# Altium project Fri3D_2024_01.PrjPcb
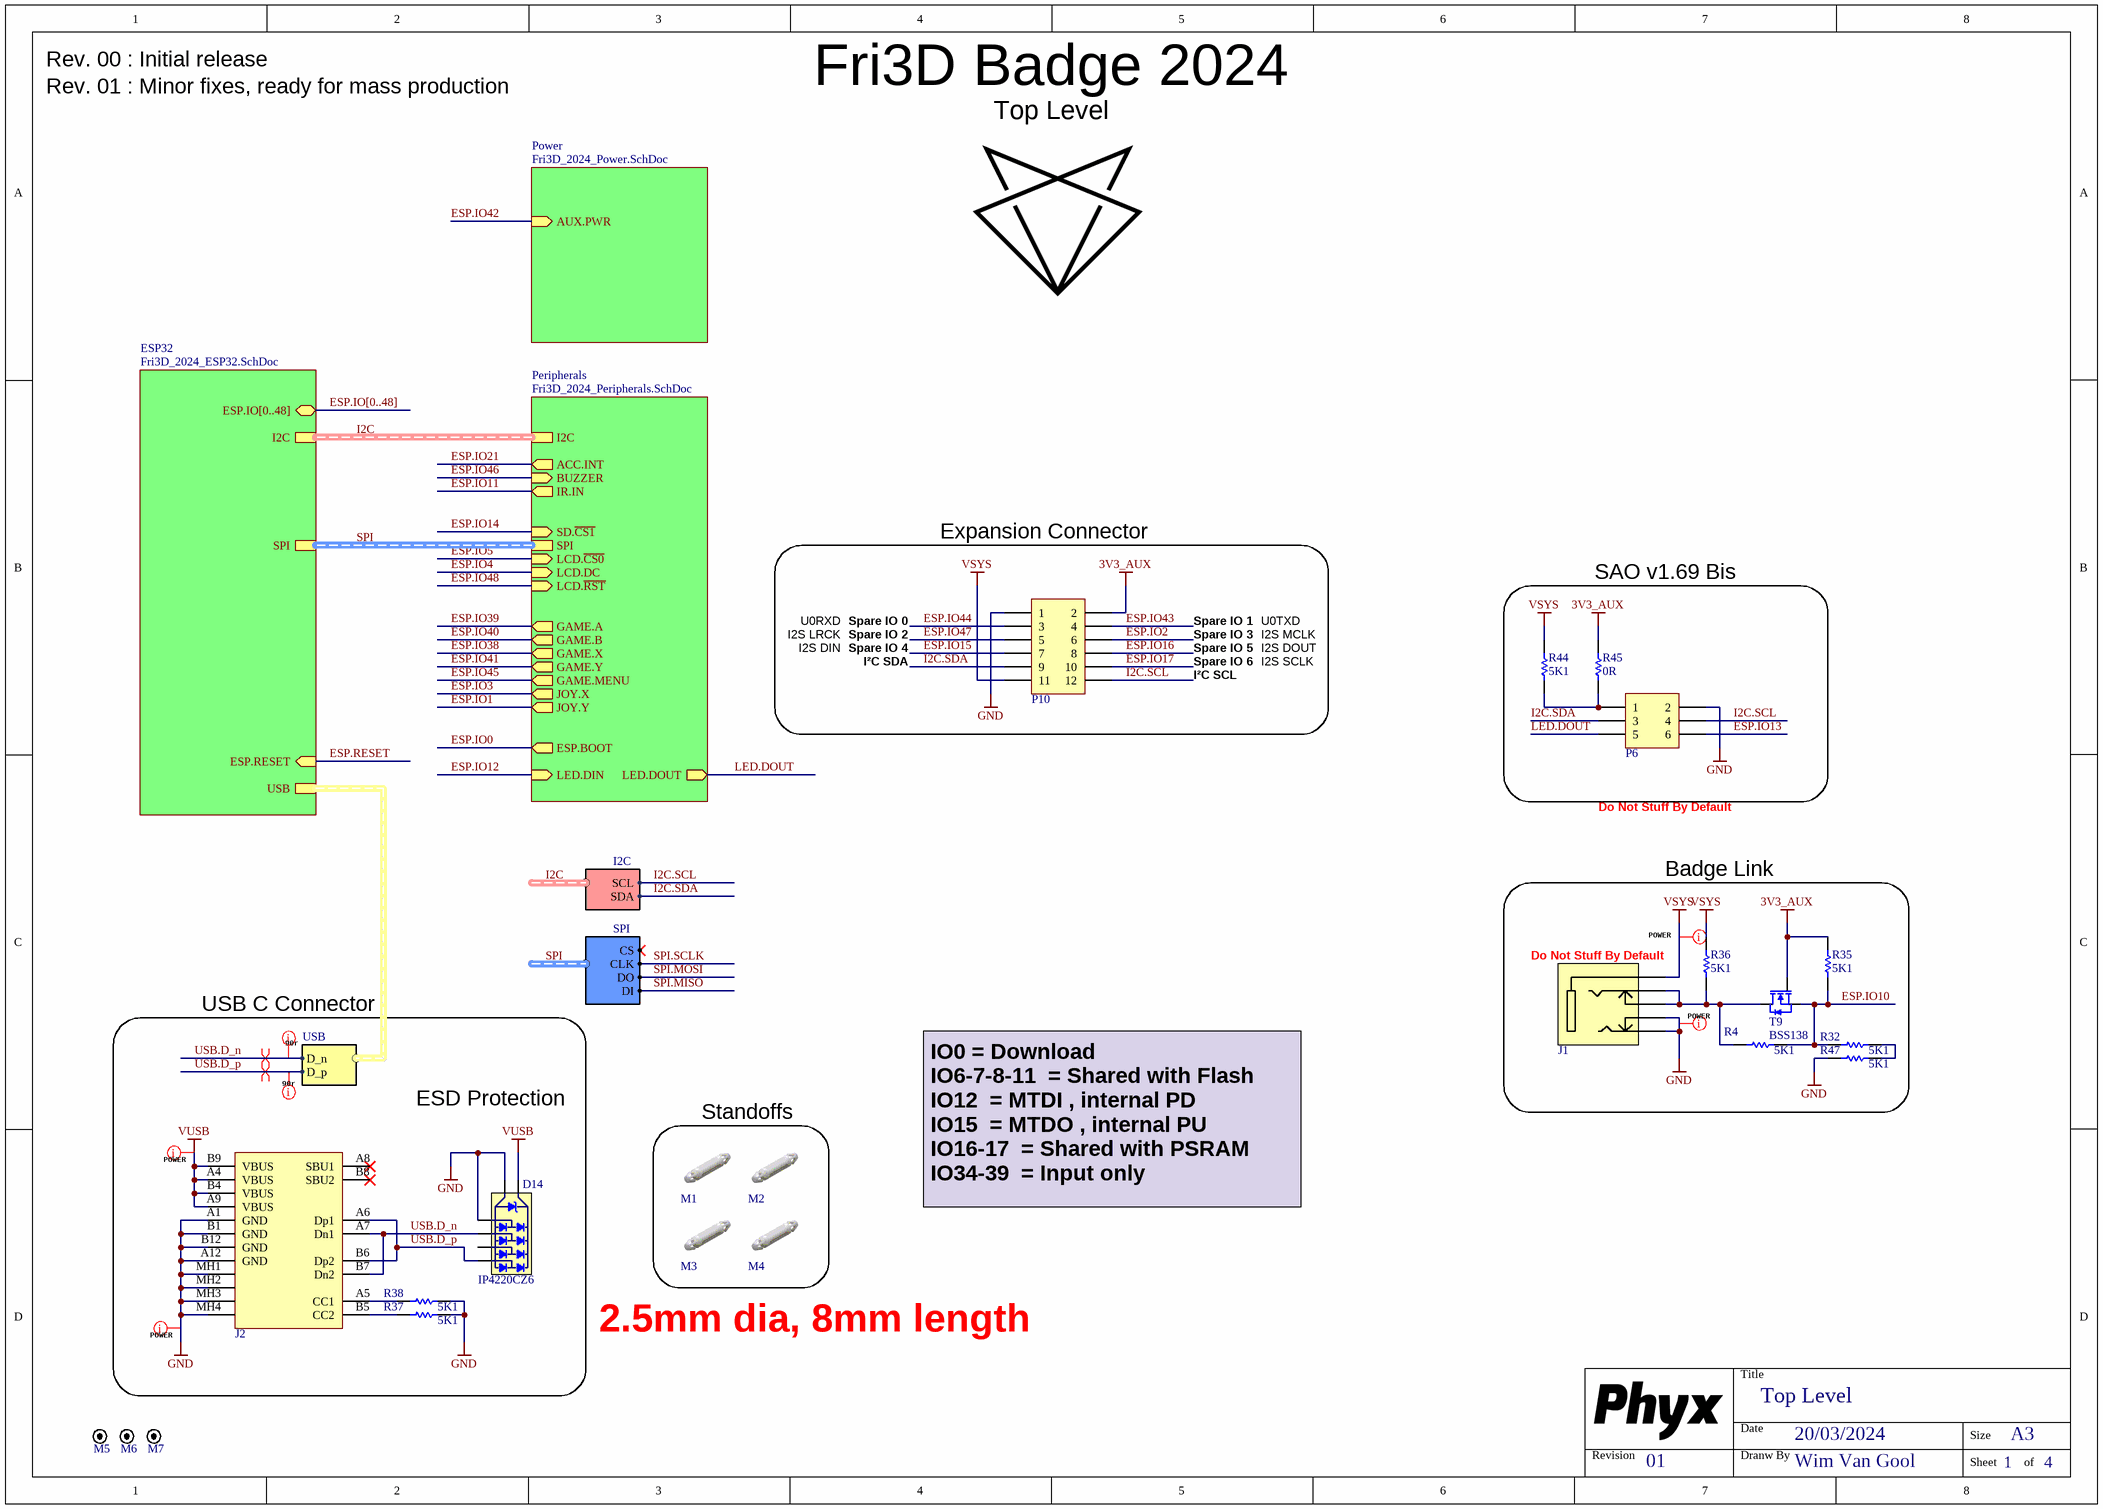
[diagram p0: Fri3D_2024_01.SchDoc]
PCB_TITLE: Fri3D Badge 2024; PCB_REV: 01; PCB_ENGINEER: WimVG
4 sheets, 104 parts. Net scope: hierarchical (ports join the sheet entries above them; power ports are global).
Board file: Fri3D_2024_01.PcbDoc
Sheets:
  Fri3D_2024_01.SchDoc
    Peripherals = Fri3D_2024_Peripherals.SchDoc
    Power = Fri3D_2024_Power.SchDoc
    ESP32 = Fri3D_2024_ESP32.SchDoc

## Sheet Fri3D_2024_01.SchDoc: Top Level
size A3; Date: 20/03/2024; DrawnBy: Wim Van Gool; DocumentNumber: 1; Revision: 01; SheetNumber: 1; SheetTotal: 4

### Parts
D14  value IP4220CZ6  [NXP_SOT457]  (hidden comment: TVS Diode Dual USB)
J1  3.5mm jack, dual switch, black, 3 contacts  [CUI_SJ1-3525NG]  (value not drawn)
J2  USB 2.0 C Reversible Receptacle Horizontal full SMD  [XUNPU-TYPEC-304S-ACP16]  (value not drawn)
M1  HIWA LCC-12 Snap-in - Snap-in 12.7mm  [WE_709622400]  (value not drawn)
M2  HIWA LCC-12 Snap-in - Snap-in 12.7mm  [WE_709622400]  (value not drawn)
M3  HIWA LCC-12 Snap-in - Snap-in 12.7mm  [WE_709622400]  (value not drawn)
M4  HIWA LCC-12 Snap-in - Snap-in 12.7mm  [WE_709622400]  (value not drawn)
M5  Fiducial 0.5mm  [FID_0.5mm]  (value not drawn)
M6  Fiducial 0.5mm  [FID_0.5mm]  (value not drawn)
M7  Fiducial 0.5mm  [FID_0.5mm]  (value not drawn)
P6  Receptacle 3x2  [RCPT2X3]  (value not drawn)
P10  Receptacle 6x2 SMD low profile  [WE_610312243021_POST]  (value not drawn)
R4  value 5K1  [R0603_N]  (hidden comment: RESISTOR)
R32  value 5K1  [R0603_N]  (hidden comment: RESISTOR)
R35  value 5K1  [R0603_N]  (hidden comment: RESISTOR)
R36  value 5K1  [R0603_N]  (hidden comment: RESISTOR)
R37  value 5K1  [R0603_N]  (hidden comment: RESISTOR)
R38  value 5K1  [R0603_N]  (hidden comment: RESISTOR)
R44  value 5K1  [R0603_N]  (hidden comment: RESISTOR)
R45  value 0R  [R0603_N]  (hidden comment: RESISTOR)
R47  value 5K1  [R0603_N]  (hidden comment: RESISTOR)
T9  value BSS138  [SOT23-3]  (hidden comment: 0.2A N-Ch MOSFET Vgs 3.2)

### Blocks framed on the sheet
Expansion Connector: P10
SAO v1.69 Bis: P6 R44 R45
Badge Link: J1 R4 R32 R35 R36 R47 T9
Standoffs: M1-M4

### Sub-sheets
ESP32 = Fri3D_2024_ESP32.SchDoc: I2C (harness I2C), USB (harness USB), SPI (harness SPI), ESP.RESET (in), ESP.IO[0..48] (bidir)
Peripherals = Fri3D_2024_Peripherals.SchDoc: I2C (harness I2C), ACC.INT (out), BUZZER (in), LED.DIN (in), LED.DOUT (out), SPI (harness SPI), IR.IN (out), LCD.DC (in), LCD.~{RST} (in), LCD.~{CS0} (in), ESP.BOOT (out), GAME.A (out), GAME.B (out), GAME.Y (out), GAME.X (out), GAME.MENU (out), SD.~{CS1} (in), JOY.X (out), JOY.Y (out)
Power = Fri3D_2024_Power.SchDoc: AUX.PWR (in)

### Harnesses
USB: D_p, D_n
I2C: SDA, SCL
SPI: CS, CLK, DO, DI

### Nets
3V3_AUX: P10.2 R35.1 R45.1 T9.1(G)
GND: D14.2(GND) D14.3 J1.2(Tip) J1.4 J2.A1(GND) J2.A12(GND) J2.B1(GND) J2.B12(GND) J2.MH1(Tab) J2.MH2(Tab) J2.MH3(Tab) J2.MH4(Tab) P6.2 P10.1 R37.2 R38.2 R47.2
VSYS: J1.1(Sleeve) P10.11 R36.1 R44.2
VUSB: D14.5(VBus) J2.A4(VBUS) J2.A9(VBUS) J2.B4(VBUS) J2.B9(VBUS)
ESP.IO2: P10.6
ESP.IO10: R4.1 R32.2 R35.2 T9.2(S)
ESP.IO13: P6.6  [project net BAT.MON]
ESP.IO15: P10.7
ESP.IO16: P10.8
ESP.IO17: P10.10
ESP.IO43: P10.4
ESP.IO44: P10.3
ESP.IO47: P10.5
I2C.SCL: P6.4 P10.12 ; sheet Peripherals/I2C.SCL
I2C.SDA: P6.3 P10.9 ; sheet Peripherals/I2C.SDA  [project net ESP.IO9]
LED.DOUT: P6.5 ; sheet Peripherals/LED.DOUT
USB.D_n: D14.1 J2.A7(Dn1) J2.B7(Dn2) ; sheet ESP32/USB.D_n
USB.D_p: D14.6 J2.A6(Dp1) J2.B6(Dp2) ; sheet ESP32/USB.D_p
NetJ1_3: J1.3(Ring) J1.5 R4.2 R36.2 T9.3(D)
NetJ2_A5: J2.A5(CC1) R38.1
NetJ2_B5: J2.B5(CC2) R37.1
NetP6_1: P6.1 R44.1 R45.2
NetR32_1: R32.1 R47.1

Not connected (* = marked no-connect by the designer): D14 4; J2 A8(SBU1)* B8(SBU2)*

### Buses and harness runs
bus ESP.IO[0..48] = sheet ESP32/ESP.IO[0..48]
harness I2C = sheet ESP32/I2C = sheet Peripherals/I2C
harness SPI = sheet ESP32/SPI = sheet Peripherals/SPI

### Layout directives
net class 90r: USB.D_n, USB.D_p
differential pair: USB.D_n, USB.D_p
net class POWER: GND, VSYS, VUSB

### Notes on the sheet
- Rev. 00 : Initial release
- Rev. 01 : Minor fixes, ready for mass production
- I2S LRCK
- I2S DIN
- U0RXD
- Spare IO 0
- I²C SDA
- Spare IO 2
- Spare IO 4
- Spare IO 1
- Spare IO 3
- Spare IO 5
- Spare IO 6
- I2S MCLK
- I2S SCLK
- I2S DOUT
- U0TXD
- I²C SCL
- Do Not Stuff By Default
- (near J1) Do Not Stuff By Default
- USB C Connector
- ESD Protection
- IO0	= Download
  IO6-7-8-11 	= Shared with Flash
  IO12 	= MTDI , internal PD
  IO15 	= MTDO , internal PU
  IO16-17 	= Shared with PSRAM
  IO34-39 	= Input only
- 2.5mm dia, 8mm length
- Title
- Revision
- Date
- Dranw By
- Size
- A3
- Sheet
- of

### Library data of the parts
D14 = TVS # IP4220CZ6 Dual USB: =Description; Supplier 1: Farnell; Supplier Part Number 1: 2143248
J1 = AUDIO JACK 3.5 3c SJ1-3525NG: =Description; Value: SJ1-3525NG; Supplier 1: Digi-key; Supplier Part Number 1: CP1-3525NG-ND
J2 = USB # C 2.0 RCPT TYPEC-304S-ACP16: Value: TYPEC-304S-ACP16; Supplier 1: LCSC; Supplier Part Number 1: C720630
M1-M4 = SPACER SNAP-SNAP LCC-12 -12.7mm: Value: LCC-12; Supplier 1: LCSC; Supplier Part Number 1: C155856
M5-M7 = Fiducial 0.5mm: FIDUCIAL; Value: NO BOM; Supplier 1: XXX; Supplier Part Number 1: FOOTPRINT ONLY
P6 = Receptacle 2.54mm dual row 6way
P10 = Receptacle # 2.54mm dual row 12way 610312243021: Value: 610312243021; Supplier 1: Wurth; Supplier Part Number 1: 610312243021; Supplier 2: Mouser; Supplier Part Number 2: 710-610312243021
R4 R32 R35-R38 R44 R47 = RES # 5K1 0603: Supplier 1: Farnell; Supplier Part Number 1: 2845922
  R4 R36: Supplier 2: LCSC; Supplier Part Number 2: C112314; Supplier 3: Generic; Supplier Part Number 3: 5K1 1% 0603
R45 = RES # 0R 0603: Supplier 1: Farnell; Supplier Part Number 1: 2447743; Supplier 3: Generic; Supplier Part Number 3: 0R 1% 0603
T9 = BSS138 N-Ch MOSFET 0.2A 3.2Vgs 60Vds: Supplier 1: Farnell; Supplier Part Number 1: 2432717

## Sheet Fri3D_2024_Peripherals.SchDoc: Peripherals
size A3; Date: 20/03/2024; DrawnBy: Wim Van Gool; DocumentNumber: 3; Revision: 01; SheetNumber: 3; SheetTotal: 4
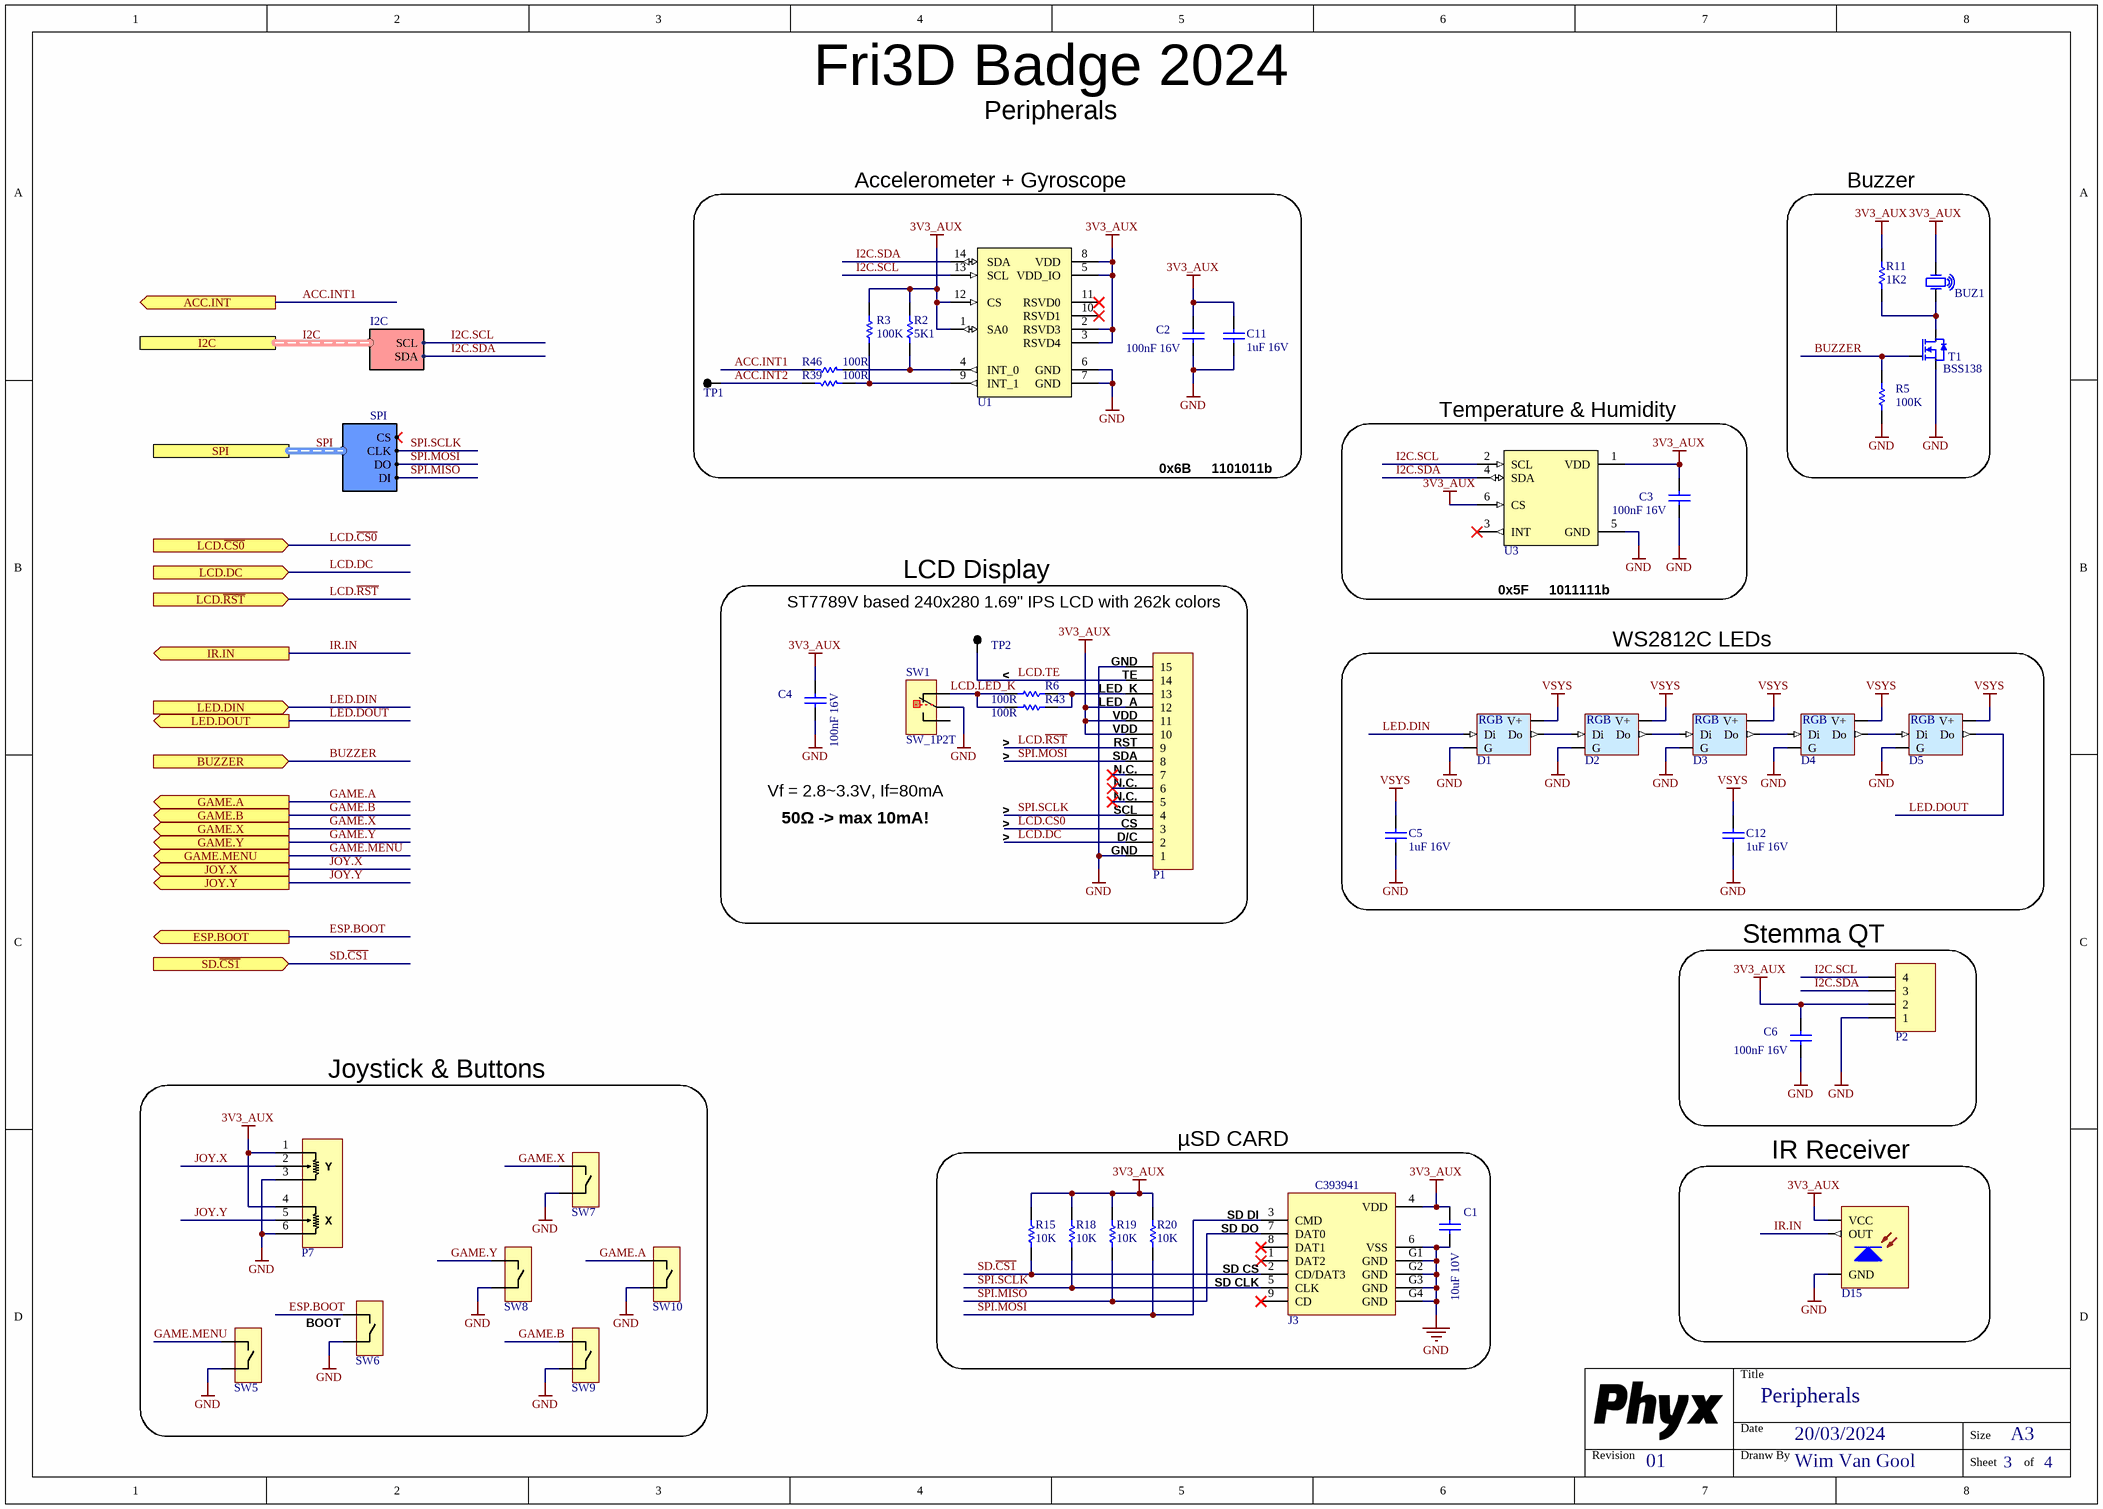
[diagram p1: Fri3D_2024_Peripherals.SchDoc]

### Parts
BUZ1  12x12x3mm Piezo Buzzer Transducer 81dB  [CUI_CMT-1203-SMT]  (value not drawn)
C1  value 10uF 10V  [C0805_N]  (hidden comment: CAP_CERAMIC)
C2  value 100nF 16V  [C0603_N]
C3  value 100nF 16V  [C0603_N]
C4  value 100nF 16V  [C0603_N]
C5  value 1uF 16V  [C0603_N]  (hidden comment: CAP_CERAMIC)
C6  value 100nF 16V  [C0603_N]
C11  value 1uF 16V  [C0603_N]  (hidden comment: CAP_CERAMIC)
C12  value 1uF 16V  [C0603_N]  (hidden comment: CAP_CERAMIC)
D1  WS2812 based digital RGB LED 5050 White package reduced current  [LED_5050_WS2812B_WHITE]  (value not drawn)
D2  WS2812 based digital RGB LED 5050 White package reduced current  [LED_5050_WS2812B_WHITE]  (value not drawn)
D3  WS2812 based digital RGB LED 5050 White package reduced current  [LED_5050_WS2812B_WHITE]  (value not drawn)
D4  WS2812 based digital RGB LED 5050 White package reduced current  [LED_5050_WS2812B_WHITE]  (value not drawn)
D5  WS2812 based digital RGB LED 5050 White package reduced current  [LED_5050_WS2812B_WHITE]  (value not drawn)
D15  ZIRM-5042B-42-Z2 Infrared Receiver 38 kHz 45° 2.7-5.5V 940nm  [CHAU_ZIRM-5042B-42-Z2]  (value not drawn)
J3  Supplier Part Number 1: C393941  [TFP09-2-12B]  (hidden comment: Micro SD PiPo Push-Push)
P1  Top contact FPC 0.3mm pitch 15 contacts  [FPC_0.3K-HX-15PWB]  (value not drawn)
P2  Header 1.0mm RA Shrouded 4  [WE_665104131822]  (value not drawn)
P7  PSP Mini Joystick  [PSP_Mini_Joystick]  (value not drawn)
R2  value 5K1  [R0603_N]  (hidden comment: RESISTOR)
R3  value 100K  [R0603_N]  (hidden comment: RESISTOR)
R5  value 100K  [R0603_N]  (hidden comment: RESISTOR)
R6  value 100R  [R0603_N]  (hidden comment: RESISTOR)
R11  value 1K2  [R0603_N]  (hidden comment: RESISTOR)
R15  value 10K  [R0603_N]  (hidden comment: RESISTOR)
R18  value 10K  [R0603_N]  (hidden comment: RESISTOR)
R19  value 10K  [R0603_N]  (hidden comment: RESISTOR)
R20  value 10K  [R0603_N]  (hidden comment: RESISTOR)
R39  value 100R  [R0603_N]  (hidden comment: RESISTOR)
R43  value 100R  [R0603_N]  (hidden comment: RESISTOR)
R46  value 100R  [R0603_N]  (hidden comment: RESISTOR)
SW1  SW_1P2T  [WE_450404015514]
SW5  SKPMAME010 6x6 TACTG Switch  [ALPS_SKPMAME010]  (value not drawn)
SW6  SKPMAME010 6x6 TACTG Switch  [ALPS_SKPMAME010]  (value not drawn)
SW7  SKPMAME010 6x6 TACTG Switch  [ALPS_SKPMAME010]  (value not drawn)
SW8  SKPMAME010 6x6 TACTG Switch  [ALPS_SKPMAME010]  (value not drawn)
SW9  SKPMAME010 6x6 TACTG Switch  [ALPS_SKPMAME010]  (value not drawn)
SW10  SKPMAME010 6x6 TACTG Switch  [ALPS_SKPMAME010]  (value not drawn)
T1  value BSS138  [SOT23-3]  (hidden comment: 0.2A N-Ch MOSFET Vgs 3.2)
TP1  TEST_PAD  [TP_1.2mm]  (value not drawn)
TP2  TEST_PAD  [TP_1.2mm]  (value not drawn)
U1  Acceleration ±2, ±4, ±8, ±16g Gyro ±125, ±250, ±500, ±1000, ±2000dps  [WE_2536030320001]  (value not drawn)
U3  WSEN-HIDS 2525020210001 temperature and humidity sensor Digital I2C  [WE_2525020210001]  (value not drawn)

### Blocks framed on the sheet
Accelerometer + Gyroscope: C2 C11 R2 R3 R39 R46 TP1 U1
Buzzer: BUZ1 R5 R11 T1
Temperature & Humidity: C3 U3
LCD Display: C4 P1 R6 R43 SW1 TP2
WS2812C LEDs: C5 C12 D1-D5
Stemma QT: C6 P2
Joystick & Buttons: P7 SW5-SW10
µSD CARD: C1 J3 R15 R18-R20
IR Receiver: D15

### Ports
ACC.INT (out), BUZZER (in), ESP.BOOT (out), GAME.A (out), GAME.B (out), GAME.MENU (out), GAME.X (out), GAME.Y (out), I2C (harness I2C), IR.IN (out), JOY.X (out), JOY.Y (out), LCD.DC (in), LCD.~{CS0} (in), LCD.~{RST} (in), LED.DIN (in), LED.DOUT (out), SD.~{CS1} (in), SPI (harness SPI)

### Harnesses
I2C: SDA, SCL
SPI: CS, CLK, DO, DI

### Nets
3V3_AUX: BUZ1.2(OSC2) C1.1 C2.1 C3.1 C4.1 C6.1 C11.1 D15.3(VCC) J3.4(VDD) P1.10 P1.11 P1.12 P2.2 P7.1 P7.4 R2.1 R3.1 R11.2 R15.1 R18.1 R19.1 R20.1 U1.1(SA0) U1.2(RSVD3) U1.3(RSVD4) U1.5(VDD_IO) U1.8(VDD) U1.12(CS) U3.1(VDD) U3.6(CS)
GND: C1.2 C2.2 C3.2 C4.2 C5.2 C6.2 C11.2 C12.2 D1.3(G) D2.3(G) D3.3(G) D4.3(G) D5.3(G) D15.2(GND) J3.6(VSS) J3.G1(GND) J3.G2(GND) J3.G3(GND) J3.G4(GND) P1.1 P1.15 P2.1 P7.3 P7.6 R5.2 SW1.2 SW5.2 SW6.2 SW7.2 SW8.2 SW9.2 SW10.2 T1.2(S) U1.6(GND) U1.7(GND) U3.5(GND)
VSYS: C5.1 C12.1 D1.1(V+) D2.1(V+) D3.1(V+) D4.1(V+) D5.1(V+)
ACC.INT1: R46.2 ; port ACC.INT
ACC.INT2: R39.2 TP1.1
BUZZER: R5.1 T1.1(G) ; port BUZZER
ESP.BOOT: SW6.1 ; port ESP.BOOT
GAME.A: SW10.1 ; port GAME.A  [project net ESP.IO39]
GAME.B: SW9.1 ; port GAME.B  [project net ESP.IO40]
GAME.MENU: SW5.1 ; port GAME.MENU  [project net ESP.IO45]
GAME.X: SW7.1 ; port GAME.X  [project net ESP.IO38]
GAME.Y: SW8.1 ; port GAME.Y  [project net ESP.IO41]
I2C.SCL: P2.4 U1.13(SCL) U3.2(SCL) ; port I2C.SCL
I2C.SDA: P2.3 U1.14(SDA) U3.4(SDA) ; port I2C.SDA  [project net ESP.IO9]
IR.IN: D15.1(OUT) ; port IR.IN  [project net ESP.IO11]
JOY.X: P7.2 ; port JOY.X  [project net ESP.IO3]
JOY.Y: P7.5 ; port JOY.Y  [project net ESP.IO1]
LCD.~{CS0}: P1.3 ; port LCD.~{CS0}  [project net ESP.IO5]
LCD.DC: P1.2 ; port LCD.DC  [project net ESP.IO4]
LCD.LED_K: R6.2 R43.2 SW1.1
LCD.~{RST}: P1.9 ; port LCD.~{RST}  [project net ESP.IO48]
LCD.TE: P1.14 TP2.1
LED.DIN: D1.4(Di) ; port LED.DIN  [project net ESP.IO12]
LED.DOUT: D5.2(Do) ; port LED.DOUT
SD.~{CS1}: J3.2(CD/DAT3) R15.2 ; port SD.~{CS1}  [project net ESP.IO14]
SPI.MISO: J3.7(DAT0) R19.2 ; port SPI.DI  [project net ESP.IO8]
SPI.MOSI: J3.3(CMD) P1.8 R20.2 ; port SPI.DO  [project net ESP.IO6]
SPI.SCLK: J3.5(CLK) P1.4 R18.2 ; port SPI.CLK  [project net ESP.IO7]
NetBUZ1_1: BUZ1.1(OSC1) R11.1 T1.3(D)
NetD1_2: D1.2(Do) D2.4(Di)
NetD2_2: D2.2(Do) D3.4(Di)
NetD3_2: D3.2(Do) D4.4(Di)
NetD4_2: D4.2(Do) D5.4(Di)
NetP1_13: P1.13 R6.1 R43.1
NetR2_2: R2.2 R46.1 U1.4(INT_0)
NetR3_2: R3.2 R39.1 U1.9(INT_1)

Not connected (* = marked no-connect by the designer): J3 1(DAT2)* 8(DAT1)* 9(CD)*; P1 5* 6* 7*; SW1 3; U1 10(RSVD1)* 11(RSVD0)*; U3 3(INT)*

### Buses and harness runs
harness I2C = port I2C
harness SPI = port SPI

### Notes on the sheet
- 0x6B
- 1101011b
- (near TP2) ST7789V based 240x280 1.69" IPS LCD with 262k colors
- (near P1) GND
- (near U3) 0x5F
- (near U3) 1011111b
- (near R6) <
- (near P1) VDD
- (near P1) LED_A
- (near P1) LED_K
- (near P1) TE
- >
- (near P1) N.C.
- (near P1) SDA
- (near P1) RST
- Vf = 2.8~3.3V, If=80mA
- 50Ω -> max 10mA!
- (near P1) D/C
- (near P1) CS
- (near P1) SCL
- (near J3) SD DI
- (near J3) SD DO
- (near J3) SD CS
- (near SW6) BOOT
- (near J3) SD CLK
- Title
- Revision
- Date
- Dranw By
- Size
- A3
- Sheet
- of
- (in symbol JOY # PSP Mini Joystick) Y; X
- (in symbol LED # RGB WS2812C-5050 WH) RGB

### Library data of the parts
BUZ1 = BUZ # CUI CMT-1203-SMT: Crystal Oscillator; Value: CMT-1203-SMT; Supplier 1: Digikey; Supplier Part Number 1: 102-2197-1-ND; Supplier 2: Aliexpress; Supplier Part Number 2: KLJ-1230
C1 = CAP # 10uF 10V 0805: Capacitor Ceramic; Supplier 1: Farnell; Supplier Part Number 1: 2320859
C2-C4 C6 = CAP # 100nF 16V 0603: Capacitor Ceramic
C5 C11 C12 = CAP # 1uF 16V 0603: Capacitor Ceramic; Supplier 1: Farnell; Supplier Part Number 1: 2320814
D1-D5 = LED # RGB WS2812C-5050 WH: =Description; Value: WS218C 5050 WH; Supplier 1: Aliexpress; Supplier Part Number 1: WS2812C Black 5050; Supplier 2: LCSC; Supplier Part Number 2: C114587
D15 = PHO # IR Rx 940nm ZIRM-5042B-42-Z2: =Description; Value: ZIRM-5042B-42-Z2; Supplier 1: LCSC; Supplier Part Number 1: C575386
J3 = MicroSD TFP09-2-12B Push-Push: =Description; Value: TFP09-2-12B; Supplier 1: LCSC
P1 = FPC # 15 Top 0.3mm 0.3K-HX-15PWB: Value: 0.3K-HX-15PWB; Supplier 1: LCSC; Supplier Part Number 1: C2919525
P2 = HDR # RA SHR 1.0mm 4way - 665104131822: Value: 665104131822; Supplier 1: Wurth; Supplier Part Number 1: 665104131822; Supplier 2: Mouser; Supplier Part Number 2: 710-665104131822
P7 = JOY # PSP Mini Joystick: Value: PSP Mini Joystick; Supplier 1: AliExpress; Supplier Part Number 1: 32958017132
R2 = RES # 5K1 0603: Supplier 3: Generic; Supplier Part Number 3: 5K1 1% 0603; Supplier 1: Farnell; Supplier Part Number 1: 2845922; Supplier 2: LCSC; Supplier Part Number 2: C112314
R3 R5 = RES # 100K 0603: Supplier 3: Generic; Supplier Part Number 3: 100K 1% 0603
R6 R39 R43 R46 = RES # 100R 0603
R11 = RES # 1K2 0603
R15 R18-R20 = RES # 10K 0603: Supplier 1: Farnell; Supplier Part Number 1: 2502397
SW1 = SW # 1P2T WS-SLSU mini slide 6,7 x 2,7 mm
SW5-SW10 = SW # TACT ALPS SKPMAME010: Value: SKPMAME010; Supplier 1: LCSC; Supplier Part Number 1: C115348; Supplier 2: Farnell; Supplier Part Number 2: 2056804; Supplier 3: Mouser; Supplier Part Number 3: 688-SKPMAM
T1 = BSS138 N-Ch MOSFET 0.2A 3.2Vgs 60Vds: Supplier 1: Farnell; Supplier Part Number 1: 2432717
TP1 TP2 = TP # 1.2mm: Value: NO BOM
U1 = ACCELERO GYRO # WSEN-ISDS: =Description; Value: 2536030320001; Supplier 1: Würth; Supplier Part Number 1: 2536030320001
U3 = TMP HUM # WSEN-HIDS: =Description; Value: 2525020210001; Supplier 1: Digi-key; Supplier Part Number 1: 1917-2525020210001CT-ND; Supplier 2: Farnell; Supplier Part Number 2: 3759082; Supplier 3: Mouser; Supplier Part Number 3: 710-2525020210001

## Sheet Fri3D_2024_Power.SchDoc: Power
size A3; Date: 20/03/2024; DrawnBy: Wim Van Gool; DocumentNumber: 4; Revision: 01; SheetNumber: 4; SheetTotal: 4
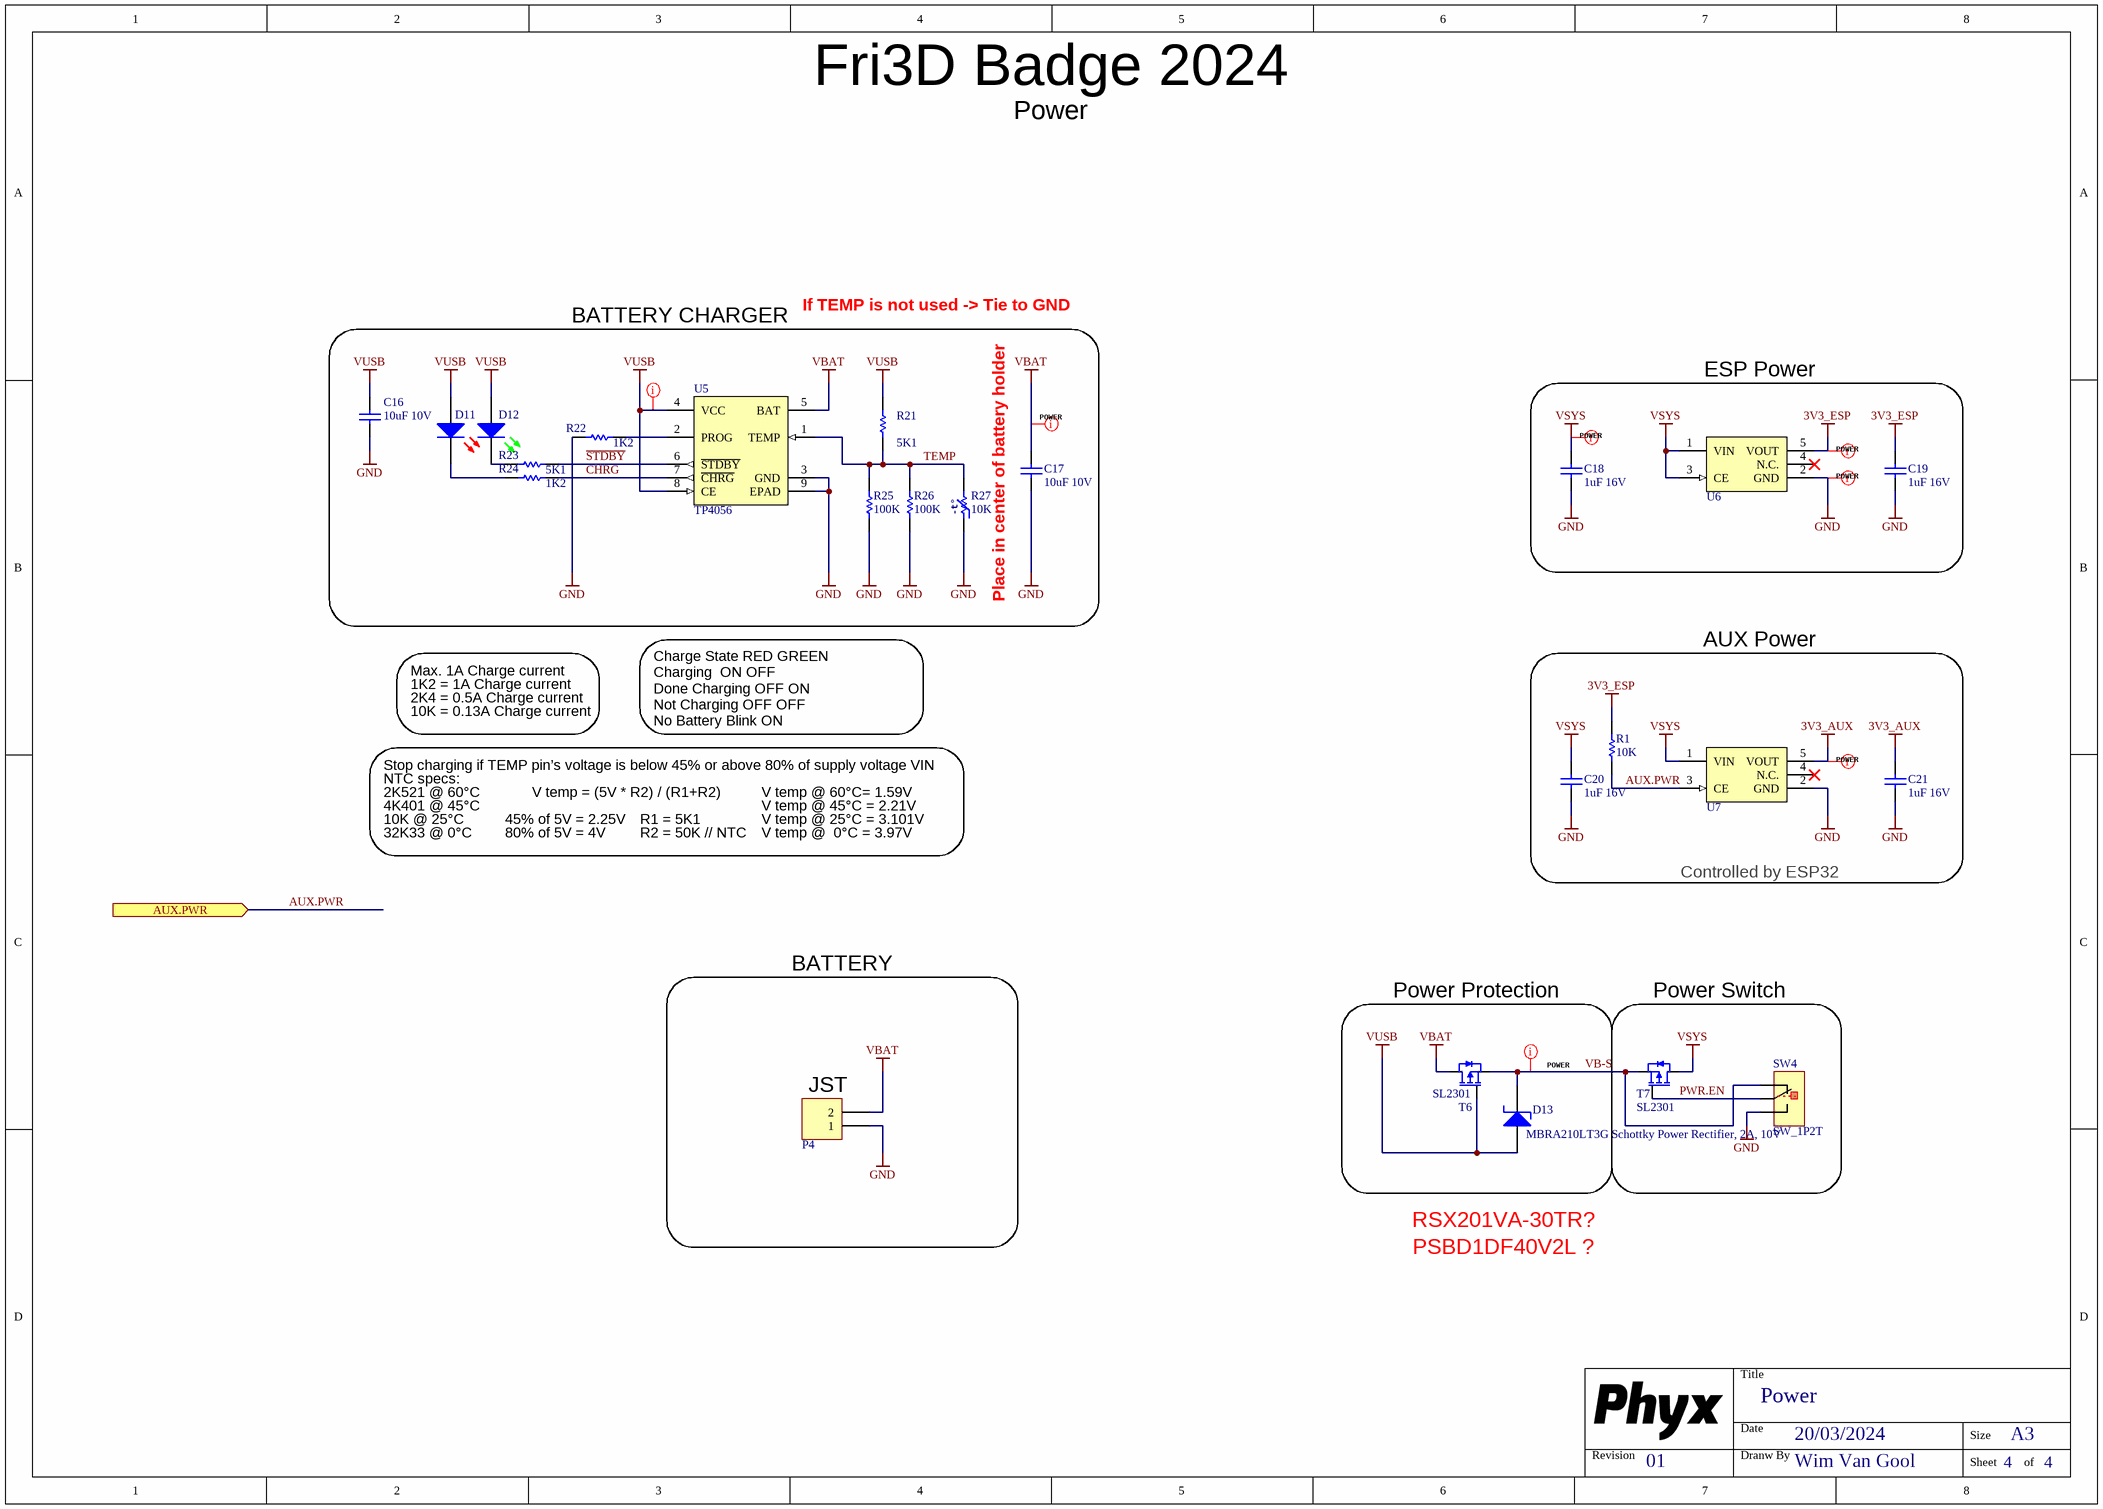
[diagram p2: Fri3D_2024_Power.SchDoc]

### Parts
C16  value 10uF 10V  [C0805_N]  (hidden comment: CAP_CERAMIC)
C17  value 10uF 10V  [C0805_N]  (hidden comment: CAP_CERAMIC)
C18  value 1uF 16V  [C0603_N]  (hidden comment: CAP_CERAMIC)
C19  value 1uF 16V  [C0603_N]  (hidden comment: CAP_CERAMIC)
C20  value 1uF 16V  [C0603_N]  (hidden comment: CAP_CERAMIC)
C21  value 1uF 16V  [C0603_N]  (hidden comment: CAP_CERAMIC)
D11  Default 0805 Red LED  [LED_0805_RD]  (value not drawn)
D12  Default 0805 Green LED  [LED_0805_GR]  (value not drawn)
D13  MBRA210LT3G Schottky Power Rectifier, 2A, 10V  [SMA_AC]
P4  Header RA 1.5mm Shrouded S2B-ZR-SM4A-TF  [JST_ZH_S2B-ZR-SM4A-TF]  (value not drawn)
R1  value 10K  [R0603_N]  (hidden comment: RESISTOR)
R21  value 5K1  [R0603_N]  (hidden comment: RESISTOR)
R22  value 1K2  [R0603_N]  (hidden comment: RESISTOR)
R23  value 5K1  [R0603_N]  (hidden comment: RESISTOR)
R24  value 1K2  [R0603_N]  (hidden comment: RESISTOR)
R25  value 100K  [R0603_N]  (hidden comment: RESISTOR)
R26  value 100K  [R0603_N]  (hidden comment: RESISTOR)
R27  value 10K  [R0402]  (hidden comment: NTC)
SW4  SW_1P2T  [WE_450404015514]
T6  value SL2301  [SOT23-3]  (hidden comment: -2.3A -20V P-Ch MOSFET Vgs -1V)
T7  value SL2301  [SOT23-3]  (hidden comment: -2.3A -20V P-Ch MOSFET Vgs -1V)
U5  value TP4056  [SOIC_N_8_TH]  (hidden comment: Single Cell LiIon charger max 1A)
U6  3V3 LDO 700mA 50mV  [SOT23-5]  (value not drawn)
U7  3V3 LDO 700mA 50mV  [SOT23-5]  (value not drawn)

### Blocks framed on the sheet
BATTERY CHARGER: C16 C17 D11 D12 R21-R27 U5
ESP Power: C18 C19 U6
AUX Power: C20 C21 R1 U7
Power Protection: D13 T6
Power Switch: SW4 T7

### Ports
AUX.PWR (in)

### Nets
3V3_AUX: C21.1 U7.5(VOUT)
3V3_ESP: C19.1 R1.1 U6.5(VOUT)
GND: C16.2 C17.2 C18.2 C19.2 C20.2 C21.2 P4.1 R22.2 R25.2 R26.2 R27.2 SW4.3 U5.3(GND) U5.9(EPAD) U6.2(GND) U7.2(GND)
VBAT: C17.1 P4.2 T6.3(D) U5.5(BAT)
VSYS: C18.1 C20.1 T7.3(D) U6.1(VIN) U6.3(CE) U7.1(VIN)
VUSB: C16.1 D11.1(A) D12.1(A) D13.A R21.1 T6.1(G) U5.4(VCC) U5.8(CE)
AUX.PWR: R1.2 U7.3(CE) ; port AUX.PWR
~{CHRG}: R24.2 U5.7(~{CHRG})
PWR.EN: SW4.2 T7.1(G)
~{STDBY}: R23.2 U5.6(~{STDBY})
TEMP: R21.2 R25.1 R26.1 R27.1 U5.1(TEMP)
VB-S: D13.C SW4.1 T6.2(S) T7.2(S)
NetD11_2: D11.2(K) R24.1
NetD12_2: D12.2(K) R23.1
NetR22_1: R22.1 U5.2(PROG)

Not connected (* = marked no-connect by the designer): U6 4(N.C.)*; U7 4(N.C.)*

### Layout directives
net class POWER: 3V3_AUX, 3V3_ESP, GND, VB-S, VBAT, VSYS, VUSB

### Notes on the sheet
- If TEMP is not used -> Tie to GND
- Place in center of battery holder
- 1K2 = 1A Charge current
- 2K4 = 0.5A Charge current
- Max. 1A Charge current
- 10K = 0.13A Charge current
- Charge State	RED	GREEN
  Charging		ON	OFF
  Done Charging	OFF	ON
  Not Charging	OFF	OFF
  No Battery	Blink	ON
- Stop charging if TEMP pin’s voltage is below 45% or above 80% of supply voltage VIN
- NTC specs:
- 10K @ 25°C
- 32K33 @ 0°C
- 2K521 @ 60°C
- 4K401 @ 45°C
- 45% of 5V = 2.25V
- 80% of 5V = 4V
- V temp = (5V * R2) / (R1+R2)
- R1 = 5K1
- R2 = 50K // NTC
- V temp @ 60°C= 1.59V
- V temp @ 45°C = 2.21V
- V temp @ 25°C = 3.101V
- V temp @  0°C = 3.97V
- Controlled by ESP32
- BATTERY
- (near P4) JST
- PSBD1DF40V2L ?
- RSX201VA-30TR?
- Title
- Revision
- Date
- Dranw By
- Size
- A3
- Sheet
- of
- (in symbol NTC # 10K 0402) -t°

### Library data of the parts
C16 C17 = CAP # 10uF 10V 0805: Capacitor Ceramic; Supplier 1: Farnell; Supplier Part Number 1: 2320859
C18-C21 = CAP # 1uF 16V 0603: Capacitor Ceramic; Supplier 1: Farnell; Supplier Part Number 1: 2320814
D11 = LED # Red 0805: =Description; Supplier 1: Farnell; Supplier Part Number 1: 2099236
D12 = LED # Green 0805: =Description; Supplier 1: Farnell; Supplier Part Number 1: 2099239
D13 = Schottky # MBRA210LT3G: =Description; Value: MBRA210LT3G; Supplier 1: LCSC; Supplier Part Number 1: C145190
P4 = HDR # RA SHR 1.5mm 2way - S2B-ZR-SM4A-TF: Value: S2B-ZR-SM4A-TF; Supplier 1: LCSC; Supplier Part Number 1: C265329; Supplier 2: Farnell; Supplier Part Number 2: 1830920; Supplier 3: Digi-Key; Supplier Part Number 3: 455-1693-1-ND
R1 = RES # 10K 0603: Supplier 1: Farnell; Supplier Part Number 1: 2502397
R21 R23 = RES # 5K1 0603: Supplier 1: Farnell; Supplier Part Number 1: 2845922
  R23: Supplier 2: LCSC; Supplier Part Number 2: C112314; Supplier 3: Generic; Supplier Part Number 3: 5K1 1% 0603
R22 R24 = RES # 1K2 0603
R25 R26 = RES # 100K 0603
R27 = NTC # 10K 0402: Supplier 1: LCSC; Supplier Part Number 1: C209959; Supplier 2: LCSC; Supplier Part Number 2: C98099
SW4 = SW # 1P2T WS-SLSU mini slide 6,7 x 2,7 mm
T6 T7 = SL2301 P-Ch MOSFET -2.3A -20Vds: =Description; Supplier 1: LCSC; Supplier Part Number 1: C181086
U5 = CHG # TP4056 LiIon 1A: =Description; Supplier 1: Aliexpress; Supplier Part Number 1: TP4056
U6 U7 = LDO # 3V3 XC6210B33: =Designator; Value: XC6210B332MR; Supplier 1: Farnell; Supplier Part Number 1: 1057803

## Sheet Fri3D_2024_ESP32.SchDoc: ESP32-S3 Module
size A3; Date: 20/03/2024; DrawnBy: Wim Van Gool; DocumentNumber: 2; Revision: 01; SheetNumber: 2; SheetTotal: 4
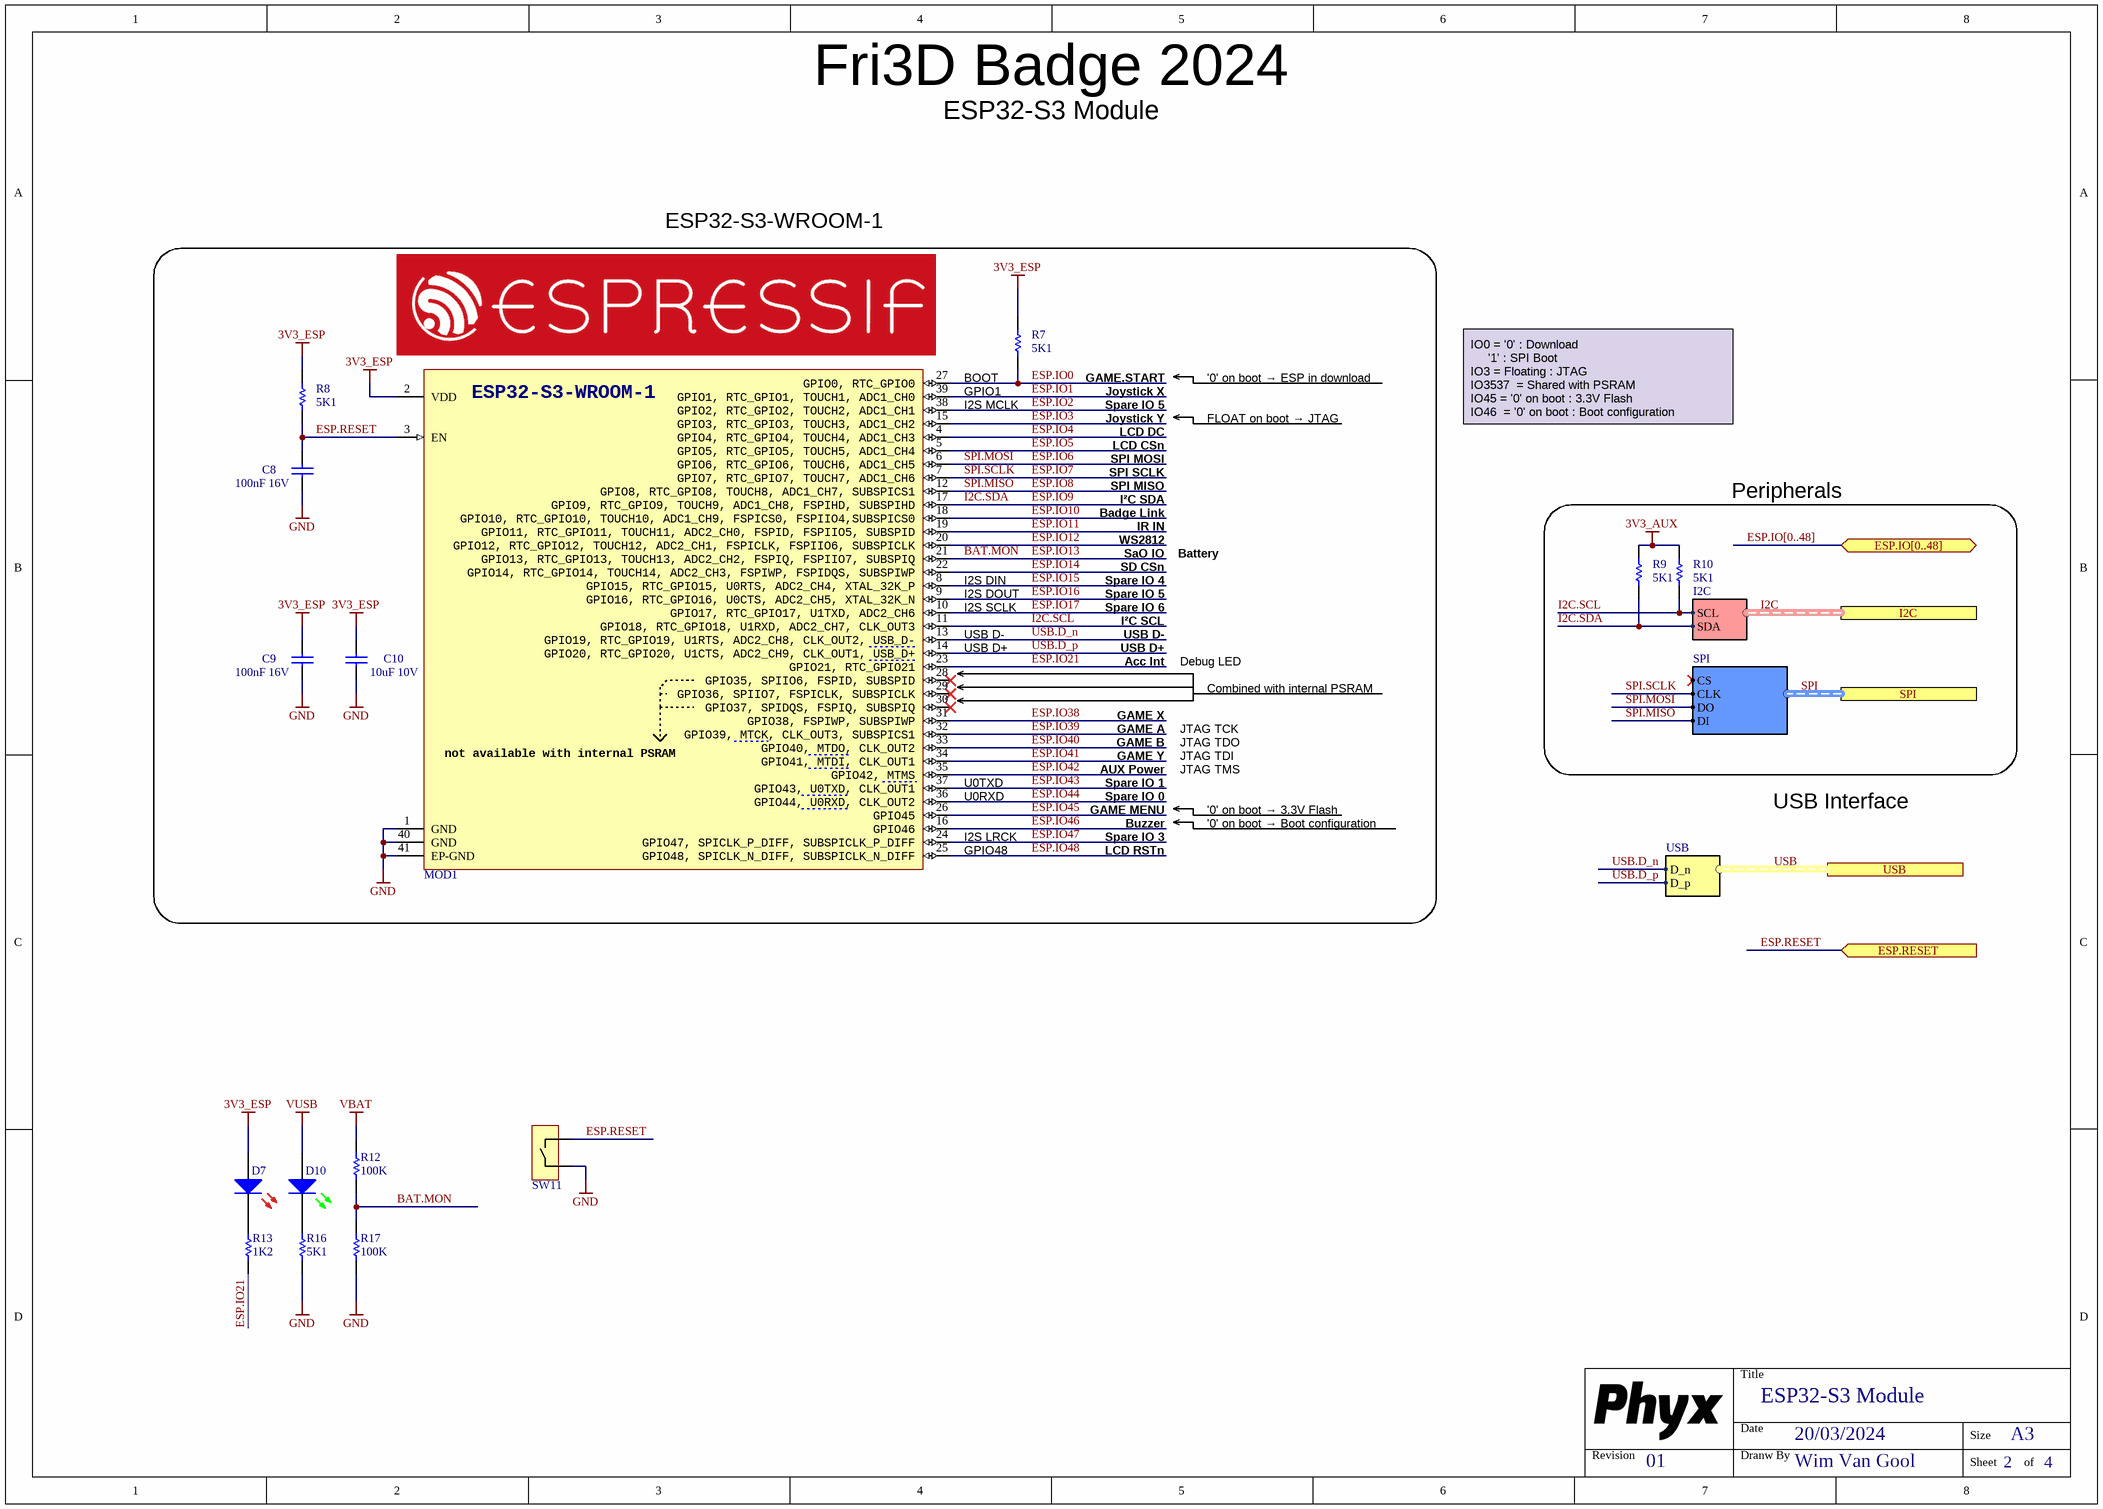
[diagram p3: Fri3D_2024_ESP32.SchDoc]

### Parts
C8  value 100nF 16V  [C0603_N]
C9  value 100nF 16V  [C0603_N]
C10  value 10uF 10V  [C0805_N]  (hidden comment: CAP_CERAMIC)
D7  Default 0805 Red LED  [LED_0805_RD]  (value not drawn)
D10  Default 0805 Green LED  [LED_0805_GR]  (value not drawn)
MOD1  ESP32-S3 based WROOM-1 16MB Flash, 8MB PSRAM  [ESP-ESP32-S3-WROOM-1]  (value not drawn)
R7  value 5K1  [R0603_N]  (hidden comment: RESISTOR)
R8  value 5K1  [R0603_N]  (hidden comment: RESISTOR)
R9  value 5K1  [R0603_N]  (hidden comment: RESISTOR)
R10  value 5K1  [R0603_N]  (hidden comment: RESISTOR)
R12  value 100K  [R0603_N]  (hidden comment: RESISTOR)
R13  value 1K2  [R0603_N]  (hidden comment: RESISTOR)
R16  value 5K1  [R0603_N]  (hidden comment: RESISTOR)
R17  value 100K  [R0603_N]  (hidden comment: RESISTOR)
SW11  SKPMAME010 6x6 TACTG Switch  [ALPS_SKPMAME010]  (value not drawn)

### Blocks framed on the sheet
ESP32-S3-WROOM-1: C8-C10 MOD1 R7 R8
Peripherals: R9 R10

### Ports
ESP.IO[0..48] (bidir), ESP.RESET (in), I2C (harness I2C), SPI (harness SPI), USB (harness USB)

### Harnesses
I2C: SDA, SCL
USB: D_p, D_n
SPI: CS, CLK, DO, DI

### Nets
3V3_AUX: R9.1 R10.1
3V3_ESP: C9.1 C10.1 D7.1(A) MOD1.2(VDD) R7.1 R8.1
GND: C8.2 C9.2 C10.2 MOD1.1(GND) MOD1.40(GND) MOD1.41(EP-GND) R16.2 R17.2 SW11.2
VBAT: R12.1
VUSB: D10.1(A)
BAT.MON: MOD1.21(GPIO13,_RTC_GPIO13,_TOUCH13,_ADC2_CH2,_FSPIQ,_FSPIIO7,_SUBSPIQ) R12.2 R17.1  [also labelled ESP.IO13]
ESP.IO0: MOD1.27(GPIO0,_RTC_GPIO0) R7.2  [project net ESP.BOOT]
ESP.IO1: MOD1.39(GPIO1,_RTC_GPIO1,_TOUCH1,_ADC1_CH0)
ESP.IO2: MOD1.38(GPIO2,_RTC_GPIO2,_TOUCH2,_ADC1_CH1)
ESP.IO3: MOD1.15(GPIO3,_RTC_GPIO3,_TOUCH3,_ADC1_CH2)
ESP.IO4: MOD1.4(GPIO4,_RTC_GPIO4,_TOUCH4,_ADC1_CH3)
ESP.IO5: MOD1.5(GPIO5,_RTC_GPIO5,_TOUCH5,_ADC1_CH4)
ESP.IO6: MOD1.6(GPIO6,_RTC_GPIO6,_TOUCH6,_ADC1_CH5) ; port SPI.DO  [also labelled SPI.MOSI]
ESP.IO7: MOD1.7(GPIO7,_RTC_GPIO7,_TOUCH7,_ADC1_CH6) ; port SPI.CLK  [also labelled SPI.SCLK]
ESP.IO8: MOD1.12(GPIO8,_RTC_GPIO8,_TOUCH8,_ADC1_CH7,_SUBSPICS1) ; port SPI.DI  [also labelled SPI.MISO]
ESP.IO9: MOD1.17(GPIO9,_RTC_GPIO9,_TOUCH9,_ADC1_CH8,_FSPIHD,_SUBSPIHD) R9.2 ; port I2C.SDA  [also labelled I2C.SDA]
ESP.IO10: MOD1.18(GPIO10,_RTC_GPIO10,_TOUCH10,_ADC1_CH9,_FSPICS0,_FSPIIO4,SUBSPICS0)
ESP.IO11: MOD1.19(GPIO11,_RTC_GPIO11,_TOUCH11,_ADC2_CH0,_FSPID,_FSPIIO5,_SUBSPID)
ESP.IO12: MOD1.20(GPIO12,_RTC_GPIO12,_TOUCH12,_ADC2_CH1,_FSPICLK,_FSPIIO6,_SUBSPICLK)
ESP.IO14: MOD1.22(GPIO14,_RTC_GPIO14,_TOUCH14,_ADC2_CH3,_FSPIWP,_FSPIDQS,_SUBSPIWP)
ESP.IO15: MOD1.8(GPIO15,_RTC_GPIO15,_U0RTS,_ADC2_CH4,_XTAL_32K_P)
ESP.IO16: MOD1.9(GPIO16,_RTC_GPIO16,_U0CTS,_ADC2_CH5,_XTAL_32K_N)
ESP.IO17: MOD1.10(GPIO17,_RTC_GPIO17,_U1TXD,_ADC2_CH6)
ESP.IO21: MOD1.23(GPIO21,_RTC_GPIO21) R13.2  [project net ACC.INT1]
ESP.IO38: MOD1.31(GPIO38,_FSPIWP,_SUBSPIWP)
ESP.IO39: MOD1.32(GPIO39,_MTCK,_CLK_OUT3,_SUBSPICS1)
ESP.IO40: MOD1.33(GPIO40,_MTDO,_CLK_OUT2)
ESP.IO41: MOD1.34(GPIO41,_MTDI,_CLK_OUT1)
ESP.IO42: MOD1.35(GPIO42,_MTMS)  [project net AUX.PWR]
ESP.IO43: MOD1.37(GPIO43,_U0TXD,_CLK_OUT1)
ESP.IO44: MOD1.36(GPIO44,_U0RXD,_CLK_OUT2)
ESP.IO45: MOD1.26(GPIO45)
ESP.IO46: MOD1.16(GPIO46)  [project net BUZZER]
ESP.IO47: MOD1.24(GPIO47,_SPICLK_P_DIFF,_SUBSPICLK_P_DIFF)
ESP.IO48: MOD1.25(GPIO48,_SPICLK_N_DIFF,_SUBSPICLK_N_DIFF)
ESP.RESET: C8.1 MOD1.3(EN) R8.2 SW11.1 ; port ESP.RESET
I2C.SCL: MOD1.11(GPIO18,_RTC_GPIO18,_U1RXD,_ADC2_CH7,_CLK_OUT3) R10.2 ; port I2C.SCL
USB.D_n: MOD1.13(GPIO19,_RTC_GPIO19,_U1RTS,_ADC2_CH8,_CLK_OUT2,_USB_D-) ; port USB.D_n
USB.D_p: MOD1.14(GPIO20,_RTC_GPIO20,_U1CTS,_ADC2_CH9,_CLK_OUT1,_USB_D+) ; port USB.D_p
NetD7_2: D7.2(K) R13.1
NetD10_2: D10.2(K) R16.1

Not connected (* = marked no-connect by the designer): MOD1 28(GPIO35,_SPIIO6,_FSPID,_SUBSPID)* 29(GPIO36,_SPIIO7,_FSPICLK,_SUBSPICLK)* 30(GPIO37,_SPIDQS,_FSPIQ,_SUBSPIQ)*

### Buses and harness runs
bus ESP.IO[0..48] = port ESP.IO[0..48]
harness I2C = port I2C
harness SPI = port SPI
harness USB = port USB

### Notes on the sheet
- BOOT
- GPIO1
- GAME.START
- Joystick X
- '0' on boot → ESP in download
- I2S MCLK
- Joystick Y
- SPI MOSI
- LCD CSn
- LCD DC
- Spare IO 5
- FLOAT on boot → JTAG
- IO0	= '0' : Download
  '1' : SPI Boot
  IO3	= Floating : JTAG
  IO3537 	= Shared with PSRAM
  IO45	= '0' on boot : 3.3V Flash
  IO46 	= '0' on boot : Boot configuration
- SPI MISO
- SPI SCLK
- I²C SDA
- Badge Link
- IR IN
- (near MOD1) I2S DIN
- (near MOD1) I2S DOUT
- SaO IO
- Spare IO 4
- WS2812
- SD CSn
- Battery
- (near MOD1) USB D-
- (near MOD1) USB D+
- (near MOD1) I2S SCLK
- USB D-
- USB D+
- I²C SCL
- Acc Int
- Spare IO 6
- Debug LED
- GAME A
- GAME X
- JTAG TCK
- Combined with internal PSRAM
- (near MOD1) U0TXD
- (near MOD1) U0RXD
- Spare IO 1
- Spare IO 0
- GAME B
- GAME Y
- AUX Power
- JTAG TDO
- JTAG TDI
- JTAG TMS
- (near MOD1) GPIO48
- (near MOD1) I2S LRCK
- LCD RSTn
- Buzzer
- GAME MENU
- Spare IO 3
- '0' on boot → 3.3V Flash
- '0' on boot → Boot configuration
- USB Interface
- Title
- Revision
- Date
- Dranw By
- Size
- A3
- Sheet
- of
- (in symbol WiFi # MOD ESP32-S3-WROOM-1-N16R8) ESP32-S3-WROOM-1; not available with internal PSRAM

### Library data of the parts
C8 C9 = CAP # 100nF 16V 0603: Capacitor Ceramic
C10 = CAP # 10uF 10V 0805: Capacitor Ceramic; Supplier 1: Farnell; Supplier Part Number 1: 2320859
D7 = LED # Red 0805: =Description; Supplier 1: Farnell; Supplier Part Number 1: 2099236
D10 = LED # Green 0805: =Description; Supplier 1: Farnell; Supplier Part Number 1: 2099239
MOD1 = WiFi # MOD ESP32-S3-WROOM-1-N16R8: WiFi # MOD ESP32-S3-WROOM-1; Value: ESP32-S3-WROOM-1-N16R8; Supplier 1: Espressif; Supplier Part Number 1: ESP32-S3-WROOM-1-N16R8; Supplier 2: Digi-key; Supplier Part Number 2: 1965-ESP32-S3-WROOM-1-N16R8DKR-ND
R7-R10 R16 = RES # 5K1 0603: Supplier 1: Farnell; Supplier Part Number 1: 2845922
  R16: Supplier 2: LCSC; Supplier Part Number 2: C112314; Supplier 3: Generic; Supplier Part Number 3: 5K1 1% 0603
R12 R17 = RES # 100K 0603
R13 = RES # 1K2 0603
SW11 = SW # TACT ALPS SKPMAME010: Value: SKPMAME010; Supplier 1: LCSC; Supplier Part Number 1: C115348; Supplier 2: Farnell; Supplier Part Number 2: 2056804; Supplier 3: Mouser; Supplier Part Number 3: 688-SKPMAM

## Nets that join several sheets
3V3_AUX: Fri3D_2024_01 (P10.2 R35.1 R45.1 T9.1), Fri3D_2024_Peripherals (30 pins), Fri3D_2024_Power (C21.1 U7.5), Fri3D_2024_ESP32 (R9.1 R10.1)
3V3_ESP: Fri3D_2024_Power (C19.1 R1.1 U6.5), Fri3D_2024_ESP32 (6 pins)
GND: Fri3D_2024_01 (17 pins), Fri3D_2024_Peripherals (36 pins), Fri3D_2024_Power (16 pins), Fri3D_2024_ESP32 (9 pins)
VBAT: Fri3D_2024_Power (C17.1 P4.2 T6.3 U5.5), Fri3D_2024_ESP32 (R12.1)
VSYS: Fri3D_2024_01 (J1.1 P10.11 R36.1 R44.2), Fri3D_2024_Peripherals (7 pins), Fri3D_2024_Power (6 pins)
VUSB: Fri3D_2024_01 (5 pins), Fri3D_2024_Power (8 pins), Fri3D_2024_ESP32 (D10.1)
ACC.INT1: Fri3D_2024_Peripherals (R46.2), Fri3D_2024_ESP32 (MOD1.23 R13.2)
AUX.PWR: Fri3D_2024_Power (R1.2 U7.3), Fri3D_2024_ESP32 (MOD1.35)
BAT.MON: Fri3D_2024_01 (P6.6), Fri3D_2024_ESP32 (MOD1.21 R12.2 R17.1)
BUZZER: Fri3D_2024_Peripherals (R5.1 T1.1), Fri3D_2024_ESP32 (MOD1.16)
ESP.BOOT: Fri3D_2024_Peripherals (SW6.1), Fri3D_2024_ESP32 (MOD1.27 R7.2)
ESP.IO1: Fri3D_2024_Peripherals (P7.5), Fri3D_2024_ESP32 (MOD1.39)
ESP.IO2: Fri3D_2024_01 (P10.6), Fri3D_2024_ESP32 (MOD1.38)
ESP.IO3: Fri3D_2024_Peripherals (P7.2), Fri3D_2024_ESP32 (MOD1.15)
ESP.IO4: Fri3D_2024_Peripherals (P1.2), Fri3D_2024_ESP32 (MOD1.4)
ESP.IO5: Fri3D_2024_Peripherals (P1.3), Fri3D_2024_ESP32 (MOD1.5)
ESP.IO6: Fri3D_2024_Peripherals (J3.3 P1.8 R20.2), Fri3D_2024_ESP32 (MOD1.6)
ESP.IO7: Fri3D_2024_Peripherals (J3.5 P1.4 R18.2), Fri3D_2024_ESP32 (MOD1.7)
ESP.IO8: Fri3D_2024_Peripherals (J3.7 R19.2), Fri3D_2024_ESP32 (MOD1.12)
ESP.IO9: Fri3D_2024_01 (P6.3 P10.9), Fri3D_2024_Peripherals (P2.3 U1.14 U3.4), Fri3D_2024_ESP32 (MOD1.17 R9.2)
ESP.IO10: Fri3D_2024_01 (R4.1 R32.2 R35.2 T9.2), Fri3D_2024_ESP32 (MOD1.18)
ESP.IO11: Fri3D_2024_Peripherals (D15.1), Fri3D_2024_ESP32 (MOD1.19)
ESP.IO12: Fri3D_2024_Peripherals (D1.4), Fri3D_2024_ESP32 (MOD1.20)
ESP.IO14: Fri3D_2024_Peripherals (J3.2 R15.2), Fri3D_2024_ESP32 (MOD1.22)
ESP.IO15: Fri3D_2024_01 (P10.7), Fri3D_2024_ESP32 (MOD1.8)
ESP.IO16: Fri3D_2024_01 (P10.8), Fri3D_2024_ESP32 (MOD1.9)
ESP.IO17: Fri3D_2024_01 (P10.10), Fri3D_2024_ESP32 (MOD1.10)
ESP.IO38: Fri3D_2024_Peripherals (SW7.1), Fri3D_2024_ESP32 (MOD1.31)
ESP.IO39: Fri3D_2024_Peripherals (SW10.1), Fri3D_2024_ESP32 (MOD1.32)
ESP.IO40: Fri3D_2024_Peripherals (SW9.1), Fri3D_2024_ESP32 (MOD1.33)
ESP.IO41: Fri3D_2024_Peripherals (SW8.1), Fri3D_2024_ESP32 (MOD1.34)
ESP.IO43: Fri3D_2024_01 (P10.4), Fri3D_2024_ESP32 (MOD1.37)
ESP.IO44: Fri3D_2024_01 (P10.3), Fri3D_2024_ESP32 (MOD1.36)
ESP.IO45: Fri3D_2024_Peripherals (SW5.1), Fri3D_2024_ESP32 (MOD1.26)
ESP.IO47: Fri3D_2024_01 (P10.5), Fri3D_2024_ESP32 (MOD1.24)
ESP.IO48: Fri3D_2024_Peripherals (P1.9), Fri3D_2024_ESP32 (MOD1.25)
I2C.SCL: Fri3D_2024_01 (P6.4 P10.12), Fri3D_2024_Peripherals (P2.4 U1.13 U3.2), Fri3D_2024_ESP32 (MOD1.11 R10.2)
LED.DOUT: Fri3D_2024_01 (P6.5), Fri3D_2024_Peripherals (D5.2)
USB.D_n: Fri3D_2024_01 (D14.1 J2.A7 J2.B7), Fri3D_2024_ESP32 (MOD1.13)
USB.D_p: Fri3D_2024_01 (D14.6 J2.A6 J2.B6), Fri3D_2024_ESP32 (MOD1.14)

## Assembly variants
Default: not fitted C1 C3 D6 D14 J1 MOD2 P4 P5 P6 P8 P9 R3 R4 R18 R19 R28 R31 R32 R34 R44 R47 T4 U2 U3